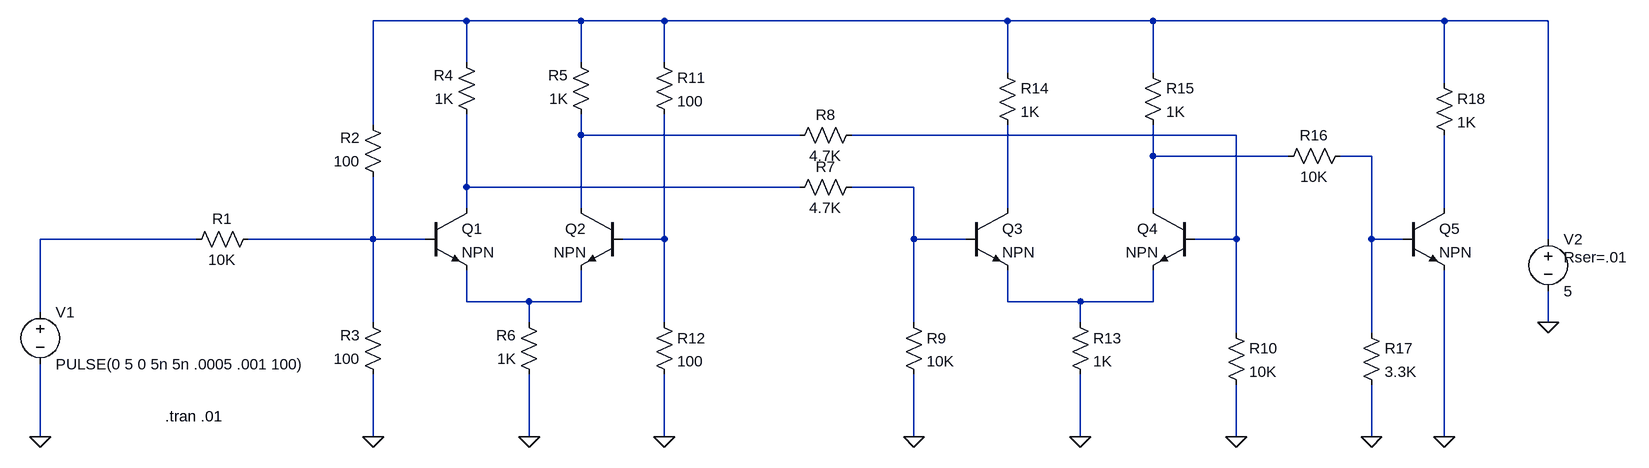
[diagram p0: schematic newBufferAmp.asc]
newBufferAmp.asc, the LTspice schematic file:
Version 4
SHEET 1 1680 680
WIRE -112 -544 -256 -544
WIRE 64 -544 -112 -544
WIRE 192 -544 64 -544
WIRE 720 -544 192 -544
WIRE 944 -544 720 -544
WIRE 1392 -544 944 -544
WIRE 1552 -544 1392 -544
WIRE -112 -480 -112 -544
WIRE 64 -480 64 -544
WIRE 192 -480 192 -544
WIRE 720 -464 720 -544
WIRE 944 -464 944 -544
WIRE 1392 -448 1392 -544
WIRE -256 -384 -256 -544
WIRE 64 -368 64 -400
WIRE 400 -368 64 -368
WIRE 1072 -368 480 -368
WIRE 944 -336 944 -384
WIRE 1152 -336 944 -336
WIRE 1280 -336 1232 -336
WIRE -112 -288 -112 -400
WIRE 400 -288 -112 -288
WIRE 576 -288 480 -288
WIRE -112 -256 -112 -288
WIRE 64 -256 64 -368
WIRE 720 -256 720 -384
WIRE 944 -256 944 -336
WIRE 1392 -256 1392 -368
WIRE -528 -208 -768 -208
WIRE -256 -208 -256 -304
WIRE -256 -208 -448 -208
WIRE -176 -208 -256 -208
WIRE 192 -208 192 -400
WIRE 192 -208 128 -208
WIRE 576 -208 576 -288
WIRE 656 -208 576 -208
WIRE 1072 -208 1072 -368
WIRE 1072 -208 1008 -208
WIRE 1280 -208 1280 -336
WIRE 1328 -208 1280 -208
WIRE 1552 -208 1552 -544
WIRE -112 -112 -112 -160
WIRE -16 -112 -112 -112
WIRE 64 -112 64 -160
WIRE 64 -112 -16 -112
WIRE 720 -112 720 -160
WIRE 832 -112 720 -112
WIRE 944 -112 944 -160
WIRE 944 -112 832 -112
WIRE -768 -96 -768 -208
WIRE -256 -80 -256 -208
WIRE -16 -80 -16 -112
WIRE 192 -80 192 -208
WIRE 576 -80 576 -208
WIRE 832 -80 832 -112
WIRE 1552 -80 1552 -128
WIRE 1072 -64 1072 -208
WIRE 1280 -64 1280 -208
WIRE -768 96 -768 -16
WIRE -256 96 -256 0
WIRE -16 96 -16 0
WIRE 192 96 192 0
WIRE 576 96 576 0
WIRE 832 96 832 0
WIRE 1072 96 1072 16
WIRE 1280 96 1280 16
WIRE 1392 96 1392 -160
FLAG -256 96 0
FLAG -768 96 0
FLAG -16 96 0
FLAG 576 96 0
FLAG 1072 96 0
FLAG 192 96 0
FLAG 832 96 0
FLAG 1280 96 0
FLAG 1392 96 0
FLAG 1552 -80 0
SYMBOL res -432 -224 R90
WINDOW 0 0 56 VBottom 2
WINDOW 3 32 56 VTop 2
SYMATTR InstName R1
SYMATTR Value 10K
SYMBOL res -240 -288 R180
WINDOW 0 36 76 Left 2
WINDOW 3 36 40 Left 2
SYMATTR InstName R2
SYMATTR Value 100
SYMBOL res -240 16 R180
WINDOW 0 36 76 Left 2
WINDOW 3 36 40 Left 2
SYMATTR InstName R3
SYMATTR Value 100
SYMBOL res -96 -384 R180
WINDOW 0 36 76 Left 2
WINDOW 3 36 40 Left 2
SYMATTR InstName R4
SYMATTR Value 1K
SYMBOL res 80 -384 R180
WINDOW 0 36 76 Left 2
WINDOW 3 36 40 Left 2
SYMATTR InstName R5
SYMATTR Value 1K
SYMBOL res 0 16 R180
WINDOW 0 36 76 Left 2
WINDOW 3 36 40 Left 2
SYMATTR InstName R6
SYMATTR Value 1K
SYMBOL res 384 -272 R270
WINDOW 0 32 56 VTop 2
WINDOW 3 0 56 VBottom 2
SYMATTR InstName R7
SYMATTR Value 4.7K
SYMBOL res 384 -352 R270
WINDOW 0 32 56 VTop 2
WINDOW 3 0 56 VBottom 2
SYMATTR InstName R8
SYMATTR Value 4.7K
SYMBOL res 560 -96 R0
SYMATTR InstName R9
SYMATTR Value 10K
SYMBOL res 1056 -80 R0
SYMATTR InstName R10
SYMATTR Value 10K
SYMBOL res 176 -496 R0
SYMATTR InstName R11
SYMATTR Value 100
SYMBOL res 176 -96 R0
SYMATTR InstName R12
SYMATTR Value 100
SYMBOL npn -176 -256 R0
SYMATTR InstName Q1
SYMBOL npn 128 -256 M0
SYMATTR InstName Q2
SYMBOL npn 656 -256 R0
SYMATTR InstName Q3
SYMBOL npn 1008 -256 M0
SYMATTR InstName Q4
SYMBOL npn 1328 -256 R0
SYMATTR InstName Q5
SYMBOL voltage -768 -112 R0
WINDOW 123 0 0 Left 2
WINDOW 39 0 0 Left 2
SYMATTR InstName V1
SYMATTR Value PULSE(0 5 0 5n 5n .0005 .001 100)
SYMBOL voltage 1552 -224 R0
WINDOW 123 0 0 Left 2
WINDOW 39 24 44 Left 2
SYMATTR SpiceLine Rser=.01
SYMATTR InstName V2
SYMATTR Value 5
SYMBOL res 816 -96 R0
SYMATTR InstName R13
SYMATTR Value 1K
SYMBOL res 704 -480 R0
SYMATTR InstName R14
SYMATTR Value 1K
SYMBOL res 928 -480 R0
SYMATTR InstName R15
SYMATTR Value 1K
SYMBOL res 1248 -352 R90
WINDOW 0 0 56 VBottom 2
WINDOW 3 32 56 VTop 2
SYMATTR InstName R16
SYMATTR Value 10K
SYMBOL res 1264 -80 R0
SYMATTR InstName R17
SYMATTR Value 3.3K
SYMBOL res 1376 -464 R0
SYMATTR InstName R18
SYMATTR Value 1K
TEXT -576 64 Left 2 !.tran .01

The netlist it stands for:
* newBufferAmp.asc
R1 N011 N010 10K
R2 N011 N001 100
R3 0 N011 100
R4 N006 N001 1K
R5 N002 N001 1K
R6 0 N013 1K
R7 N006 N007 4.7K
R8 N002 N003 4.7K
R9 N007 0 10K
R10 N003 0 10K
R11 N001 N012 100
R12 N012 0 100
Q1 N006 N011 N013 0 NPN
Q2 N002 N012 N013 0 NPN
Q3 N008 N007 N014 0 NPN
Q4 N004 N003 N014 0 NPN
Q5 N009 N005 0 0 NPN
V1 N010 0 PULSE(0 5 0 5n 5n .0005 .001 100)
V2 N001 0 5 Rser=.01
R13 N014 0 1K
R14 N001 N008 1K
R15 N001 N004 1K
R16 N005 N004 10K
R17 N005 0 3.3K
R18 N001 N009 1K
.model NPN NPN
.model PNP PNP
.lib standard.bjt
.tran .01
.backanno
.end